# EAGLE design v3.0 (EAGLE 9.4.2)
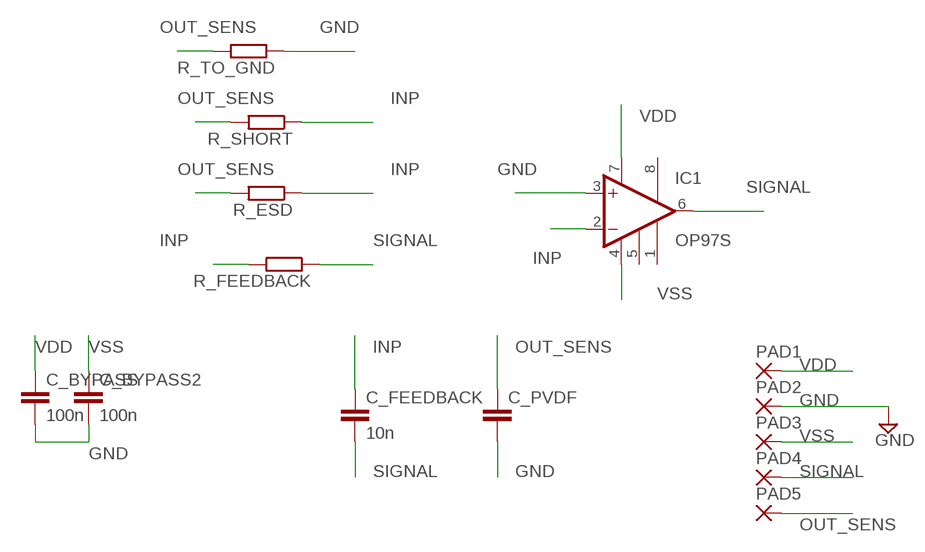
[diagram p0: schematic, sheet 1]

## Parts
C_BYPASS  100n  C-EUC0805  [C0805]
C_BYPASS2  100n  C-EUC0805  [C0805]
C_FEEDBACK  10n  C-EUC0805  [C0805]
C_PVDF  C-EUC0805  [C0805]
IC1  OP97S  [SO08]
PAD1  SMD5  [SMD2,54-5,08]
PAD2  SMD5  [SMD2,54-5,08]
PAD3  SMD5  [SMD2,54-5,08]
PAD4  SMD5  [SMD2,54-5,08]
PAD5  SMD5  [SMD2,54-5,08]
R_ESD  1M  R-EU_M0805  [M0805]
R_FEEDBACK  100M  R-EU_M0805  [M0805]
R_SHORT  1M  R-EU_M0805  [M0805]
R_TO_GND  1M  R-EU_M0805  [M0805]

## Nets
GND: C_BYPASS2.2 C_BYPASS.2 C_PVDF.2 IC1.3(+IN) PAD2.1(P) R_TO_GND.1
INP: C_FEEDBACK.1 IC1.2(-IN) R_ESD.1 R_FEEDBACK.2 R_SHORT.1
OUT_SENS: C_PVDF.1 PAD5.1(P) R_ESD.2 R_SHORT.2 R_TO_GND.2
SIGNAL: C_FEEDBACK.2 IC1.6(OUT) PAD4.1(P) R_FEEDBACK.1
VDD: C_BYPASS.1 IC1.7(V+) PAD1.1(P)
VSS: C_BYPASS2.1 IC1.4(V-) PAD3.1(P)
Unconnected: IC1.1(BAL1) IC1.5(COMP) IC1.8(BAL2)

## Library data of the parts
C_BYPASS C_BYPASS2 = resistor:C-EU: CAPACITOR, European symbol
C_FEEDBACK C_PVDF = rcl:C-EU: CAPACITOR, European symbol; SPICEPREFIX: C
IC1 = linear:OP97: Low Power, High Precision Operational Amplifier Source: http://www.analog.com/static/imported-files/data_sheets/OP97.pdf
PAD1-PAD5 = wirepad:SMD5: SMD PAD
R_ESD R_FEEDBACK R_SHORT R_TO_GND = rcl:R-EU_: RESISTOR, European symbol; SPICEPREFIX: R

## Board
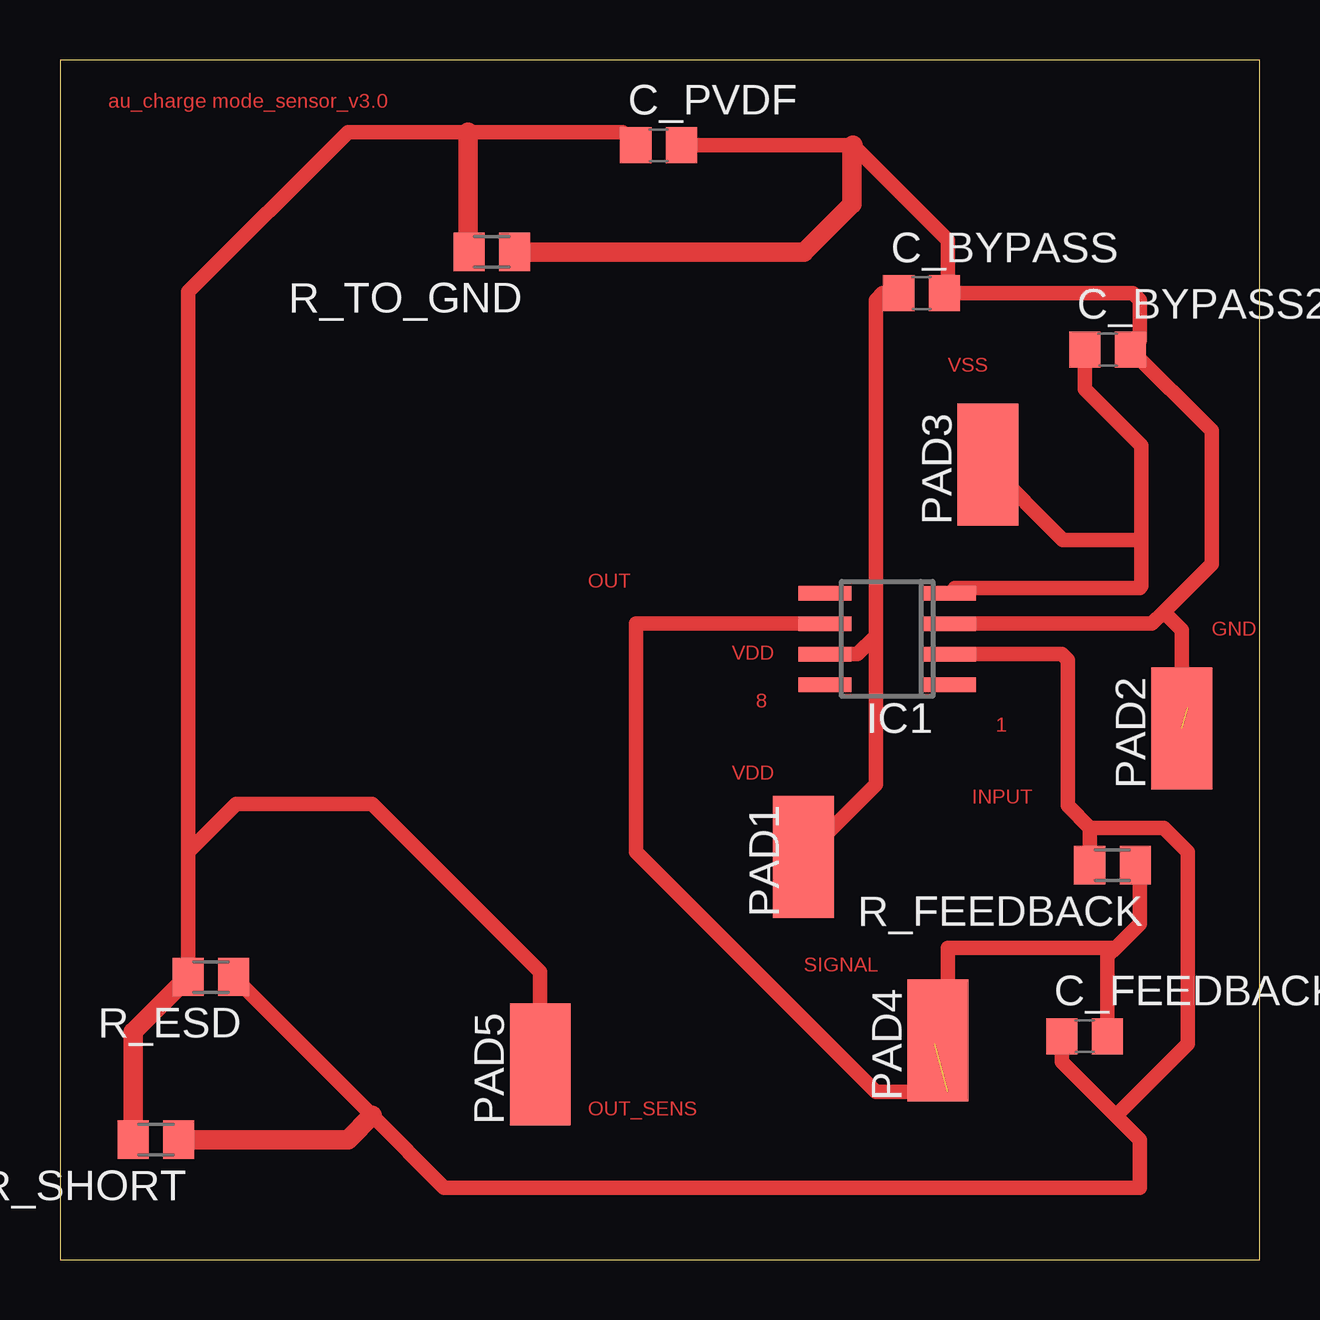
[diagram p1: board, top side]

Size 50 x 50 mm. Coordinates in mm from the lower left corner, seen from the top.
Outline: 0,0 50,0 50,50 0,50 0,0
Copper layers (1*16): Top 0.035mm / dielectric 1.5mm / Bottom 0.035mm
Design rules "TM_medit_aetzen": minimum track width 10mil, minimum drill 8mil, track to track 10mil, track to pad 10mil, pad to pad 10mil, via to via 15mil, smd to smd 8mil, copper to edge 40mil, drill to drill 8mil, minimum pad ring 10mil, minimum via ring 8mil, stop-mask expansion 4mil, vias tented up to drill 0mil, thermal gap 10mil

### Footprints (pad centres in the part's own frame; a part is rotated, then mirrored left to right if it is on the bottom)
C0805 = smd 1.3 x 1.5: 1 -0.95,0; 2 0.95,0
SO08 = smd 0.6 x 2.2: 1 -1.905,-2.6; 2 -0.635,-2.6; 3 0.635,-2.6; 4 1.905,-2.6; 5 1.905,2.6; 6 0.635,2.6; 7 -0.635,2.6; 8 -1.905,2.6
SMD2,54-5,08 = smd 2.54 x 5.08: 1 0,0
M0805 = smd 1.3 x 1.6: 1 -0.95,0; 2 0.95,0

### Placement (x,y rotation side)
C_BYPASS  35.91,40.28 0 top
C_BYPASS2  43.67,37.93 0 top
C_FEEDBACK  42.71,9.31 0 top
C_PVDF  24.95,46.44 0 top
IC1  34.48,25.87 90 top
PAD1  30.98,16.78 0 top
PAD2  46.76,22.13 0 top
PAD3  38.68,33.13 0 top
PAD4  36.6,9.13 0 top
PAD5  20.02,8.13 0 top
R_ESD  6.29,11.78 180 top
R_FEEDBACK  43.87,16.43 180 top
R_SHORT  4,5 180 top
R_TO_GND  18,42 180 top

### Tracks (layer width: path | path; a pad name or v marks a point on that pad's centre or on a via)
GND  (1 unrouted)
  Top 0.61: C_PVDF.2 33.06,46.44 37,42.5 37,40.42 C_BYPASS.2 44.72,40.28 45,40 45,38.31 C_BYPASS2.2 48,34.55 48,29 46,27 | IC1.3 45.51,26.5 46,27 | 46,24 47,23 | 46,27 46.76,26.24 PAD2.1
  Top 0.813: R_TO_GND.1 31,42 33,44 33,46.38 33.06,46.44
INP
  Top 0.61: 42.92,18 R_FEEDBACK.2 | 42.92,18 46,18 47,17 47,9 44,6 | 44,6 41.76,8.24 C_FEEDBACK.1 | R_ESD.1 13.01,6.01 16.02,3 45,3 45,5 44,6 | 42.92,18 42,18.92 42,25 41.77,25.23 IC1.2
  Top 0.813: R_SHORT.1 12,5 13.01,6.01
OUT_SENS
  Top 0.61: R_ESD.2 5.34,17 | 5.34,17 5.34,40.34 12,47 17,47 23.44,47 C_PVDF.1 | 5.34,17 7.34,19 13,19 20,12 20,8.15 PAD5.1
  Top 0.813: R_SHORT.2 3.05,9.49 R_ESD.2 | R_TO_GND.2 17,42.05 17,47
SIGNAL  (1 unrouted)
  Top 0.61: C_FEEDBACK.2 43.66,12.66 44,13 | 44,13 45,14 45,16.25 R_FEEDBACK.1 | IC1.6 24,26.5 24,17 34,7 37,7 37,13 44,13 | PAD4.1 36.47,9 36,9
VDD
  Top 0.61: IC1.7 33.23,25.23 34,26 | 34,26 34,40 34.28,40.28 C_BYPASS.1 | PAD1.1 34,19.8 34,26
VSS
  Top 0.61: C_BYPASS2.1 42.72,36.28 45.08,33.92 45.08,30 | IC1.4 37.3,28 45,28 45.08,28.08 45.08,30 | PAD3.1 41.81,30 45.08,30

### Text on the board
Top: au_charge mode_sensor_v3.0 | VSS | OUT | GND | VDD | 8 | 1 | VDD | INPUT | SIGNAL | OUT_SENS